# Altium project Sist. de Seguridad LilyGO.PrjPcb
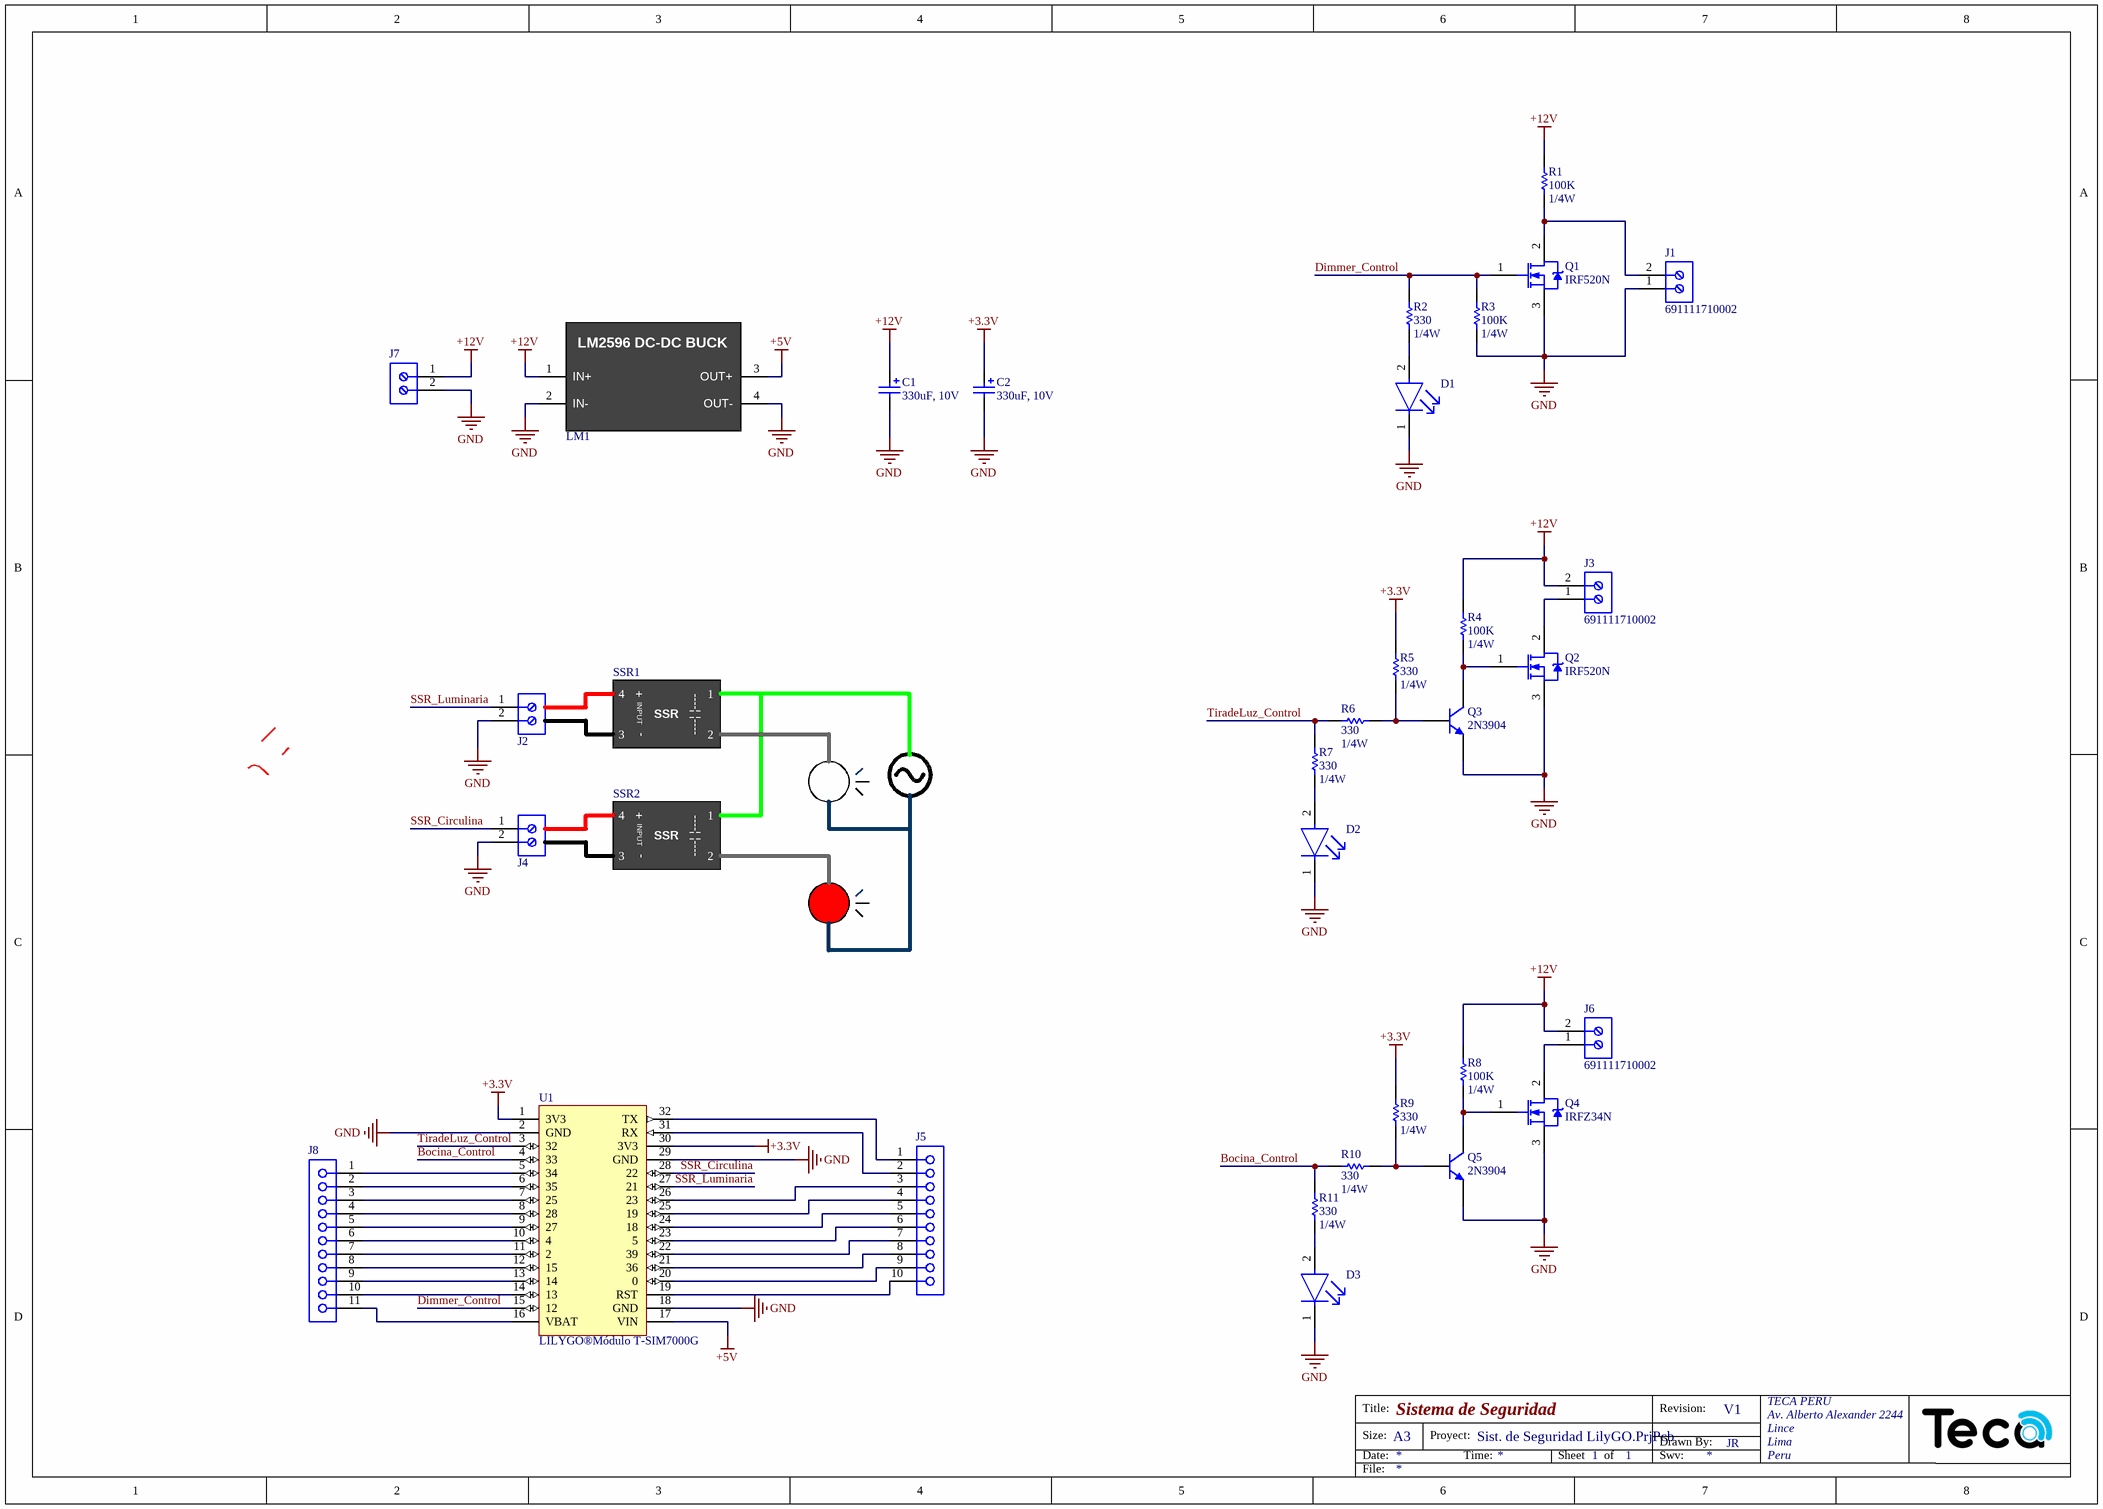
[diagram p0: Ctrl Sist de seguridad SCH.SchDoc]
CAGE_CODE: ?????; CONTRACT_NUMBER: <CONTRACT NO>; DOC_NO_ASSY_DWG: <ASSY DWG NO>; DOC_NO_BOM: <BOM DOC NO>; DOC_NO_FAB_DWG: <FAB DWG NO>; DOC_NO_SCH_DWG: <SCH DWG NO>; PCB_2_DEC_TOL: +/-.01; PCB_3_DEC_TOL: +/-.010; PCB_ANG_TOL: +/-1/2; PCB_ASSEMBLY_NO: <PCB ASSY NO>; PCB_CHECKER: - -----; PCB_CHECKER_APP_DATE: --/--/----; PCB_DESIGNER: - -----; PCB_DESIGNER_APP_DATE: --/--/----; PCB_DWG_NO: <PCB DWG NO>; PCB_ENGINEER: - -----; PCB_ENGINEER_APP_DATE: --/--/----; PCB_PART_NUMBER: <PCB PN>; PCB_REV: A; SCH_REV: A
1 sheet, 33 parts. Net scope: global (net labels, ports and power ports of the same name join across sheets).
Board file: Ctrl Sist de seguridad PCB.PcbDoc

## Sheet Ctrl Sist de seguridad SCH.SchDoc: Sistema de Seguridad
size A3; DrawnBy: JR; Organization: TECA PERU; Address1: Av. Alberto Alexander 2244; Address2: Lince; Address3: Lima; Address4: Peru; Revision: V1; SheetNumber: 1; SheetTotal: 1; ENG_APP_DATE: --/--/--; DSN_APP_DATE: --/--/--; CHK_APP_DATE: --/--/--

### Parts
C1  330uF, 10V  [WCAP-ATLI_D8H11.5]
C2  330uF, 10V  [WCAP-ATLI_D8H11.5]
D1  HLMP-4700  [FP-HLMP-4700-MFG]  (value not drawn)
D2  HLMP-4700  [FP-HLMP-4700-MFG]  (value not drawn)
D3  HLMP-4700  [FP-HLMP-4700-MFG]  (value not drawn)
J1  691111710002  [691111710002]
J2  691111710002  [691111710002]  (value not drawn)
J3  691111710002  [691111710002]
J4  691111710002  [691111710002]  (value not drawn)
J5  61301011821  [61301011821]  (value not drawn)
J6  691111710002  [691111710002]
J7  691111710002  [691111710002]  (value not drawn)
J8  61301111821  [61301111821]  (value not drawn)
LM1  LM2596?  [LM2596]  (value not drawn)
Q1  IRF520N  [INTR-TO-220AB-3]
Q2  IRF520N  [INTR-TO-220AB-3]
Q3  2N3904  [TO-92A]
Q4  IRFZ34N  [INTR-TO-220AB-3]
Q5  2N3904  [TO-92A]
R1  Resistance: 100K  Power Rating: 1/4W  [RESISTOR 1/4W - 10mm]  (hidden comment: Resistor 1/4W)
R2  Resistance: 330  Power Rating: 1/4W  [RESISTOR 1/4W - 10mm]  (hidden comment: Resistor 1/4W)
R3  Resistance: 100K  Power Rating: 1/4W  [RESISTOR 1/4W - 10mm]  (hidden comment: Resistor 1/4W)
R4  Resistance: 100K  Power Rating: 1/4W  [RESISTOR 1/4W - 10mm]  (hidden comment: Resistor 1/4W)
R5  Resistance: 330  Power Rating: 1/4W  [RESISTOR 1/4W - 10mm]  (hidden comment: Resistor 1/4W)
R6  Resistance: 330  Power Rating: 1/4W  [RESISTOR 1/4W - 10mm]  (hidden comment: Resistor 1/4W)
R7  Resistance: 330  Power Rating: 1/4W  [RESISTOR 1/4W - 10mm]  (hidden comment: Resistor 1/4W)
R8  Resistance: 100K  Power Rating: 1/4W  [RESISTOR 1/4W - 10mm]  (hidden comment: Resistor 1/4W)
R9  Resistance: 330  Power Rating: 1/4W  [RESISTOR 1/4W - 10mm]  (hidden comment: Resistor 1/4W)
R10  Resistance: 330  Power Rating: 1/4W  [RESISTOR 1/4W - 10mm]  (hidden comment: Resistor 1/4W)
R11  Resistance: 330  Power Rating: 1/4W  [RESISTOR 1/4W - 10mm]  (hidden comment: Resistor 1/4W)
SSR1  SSR  [SSR Generic]  (value not drawn)
SSR2  SSR  [SSR Generic]  (value not drawn)
U1  LILYGO®Módulo T-SIM7000G  [LILYGO T-SIM7000G]

### Nets
+3.3V: C2.1(P) R5.2 R9.2 U1.1(3V3) U1.30(3V3)
+5V: LM1.3(OUT+) U1.17(VIN)
+12V: C1.1(P) J3.2 J6.2 J7.1 LM1.1(IN+) R1.2 R4.2 R8.2
GND: C1.2(N) C2.2(N) D1.1(C) D2.1(C) D3.1(C) J1.1 J2.2 J4.2 J7.2 LM1.2(IN-) LM1.4(OUT-) Q1.3(S) Q2.3(S) Q3.1(E) Q4.3(S) Q5.1(E) R3.1 U1.2(GND) U1.18(GND) U1.29(GND)
Bocina_Control: R10.2 R11.1 U1.4(33)
Dimmer_Control: Q1.1(G) R2.2 R3.2 U1.15(12)
SSR_Circulina: J4.1 U1.28(22)
SSR_Luminaria: J2.1 U1.27(21)
TiradeLuz_Control: R6.2 R7.1 U1.3(32)
NetD1_2: D1.2(A) R2.1
NetD2_2: D2.2(A) R7.2
NetD3_2: D3.2(A) R11.2
NetJ1_2: J1.2 Q1.2(D) R1.1
NetJ3_1: J3.1 Q2.2(D)
NetJ5_1: J5.1 U1.32(TX)
NetJ5_2: J5.2 U1.31(RX)
NetJ5_3: J5.3 U1.26(23)
NetJ5_4: J5.4 U1.25(19)
NetJ5_5: J5.5 U1.24(18)
NetJ5_6: J5.6 U1.23(5)
NetJ5_7: J5.7 U1.22(39)
NetJ5_8: J5.8 U1.21(36)
NetJ5_9: J5.9 U1.20(0)
NetJ5_10: J5.10 U1.19(RST)
NetJ6_1: J6.1 Q4.2(D)
NetJ8_1: J8.1 U1.5(34)
NetJ8_2: J8.2 U1.6(35)
NetJ8_3: J8.3 U1.7(25)
NetJ8_4: J8.4 U1.8(28)
NetJ8_5: J8.5 U1.9(27)
NetJ8_6: J8.6 U1.10(4)
NetJ8_7: J8.7 U1.11(2)
NetJ8_8: J8.8 U1.12(15)
NetJ8_9: J8.9 U1.13(14)
NetJ8_10: J8.10 U1.14(13)
NetJ8_11: J8.11 U1.16(VBAT)
NetQ2_1: Q2.1(G) Q3.3(C) R4.1
NetQ3_2: Q3.2(B) R5.1 R6.1
NetQ4_1: Q4.1(G) Q5.3(C) R8.1
NetQ5_2: Q5.2(B) R9.1 R10.1

### Notes on the sheet
- Title:
- Size:
- Date:
- A3
- Proyect:
- Time:
- Sheet
- of
- Revision:
- Drawn By:
- Swv:
- File:
- (in symbol LM2596?) LM2596 DC-DC BUCK
- (in symbol SSR) 4; +; 1; INPUT; ----| |----; 3; -; 2

### Library data of the parts
C1 C2 = 860080274009: WCAP-ATLI Aluminum Electrolytic Capacitor, Radial, THT, D8xH11.5mm, 330uF, 10V; Manufacturer: Wurth Elektronik; Ripple Current: 540mA; Technical Reference: ATEE115331M010DSPA7C000; Rated Voltage: 10VDC; Leakage Current: 33uA; Endurance: 3000h; Dissipation Factor: 14%; Capacitance Tolerance: +/-20%; Capacitance: 330uF; Manufacturer Part Number: 860080274009; Published Date: October 2020; Packaging: Ammo Pack; Operating Temperature: -55 to +105degC; Mounting Technology: THT; Height: 11.5mm; Diameter: 8mm; ComponentLink2URL: https://www.we-online.com/catalog/datasheet/860080274009.pdf; ComponentLink2Description: Datasheet; ComponentLink1URL: http://www.we-online.de; ComponentLink1Description: Manufacturer
D1-D3 = CMP-18399-000008-1: LED RED DIFFUSED T-1 3/4 T/H; Manufacturer: Broadcom; Luminous Intensity: 2.3mcd; Peak Emmision Wavelength: 635nm; Forward Voltage: 1.7V; Viewing Angle: 50°; Led Orientation: Straight; Reverse Voltage: 5V; Forward Current: 2mA; Power Dissipation: 14mW; Wavelength: 626nm; Digikey Description: LED RED DIFFUSED T-1 3/4 T/H; Device Class L3: unset; Temperature Range Low: -40°C; Temperature Range High: +100°C; RoHS: TRUE; Package: HLMP-4700; Octopart: https://octopart.com/hlmp-4700-broadcom-71130526; Automotive: No; ComponentLink2URL: https://docs.broadcom.com/docs/AV02-1557EN; Colour: Red; Temperature: -40°C to +100°C; Lead Free: Yes; Category: Diode; ComponentLink2Description: Datasheet; Manufacturer Part Number: HLMP-4700; Device Class L1: Optoelectronics; Device Class L2: LEDs; Mouser Description: LED; Red; 2.3mcd; 0.24In.Dia.; T-1-3/4; 500mA; 1.7V; 635nm; 50deg; 5V; 24mW; -55degC;
J1-J4 J6 J7 = 691111710002: WR-TBL Serie 111 Horizontal Entry Modular, Pressure Clamp, THT, pitch 5mm, 2p; Manufacturer: Wurth Elektronik; Modularity: Yes; PCB/Cable/Panel: PCB; Pin Number: 2; Rated Current [UL]: 15A; Working Voltage [UL]: 250VAC; ComponentLink1Description: Manufacturer; ComponentLink1URL: http://www.we-online.de; ComponentLink2URL: https://katalog.we-online.de/em/datasheet/691111710002.pdf; ComponentLink2Description: Datasheet; Mounting Technology: THT; Manufacturer Part Number: 691111710002; Packaging: Box; Operating Temperature: -40 to +105degC; Pitch: 5mm; Published Date: Feburary 2021; Type: Horizontal; Application: Pressure Clamp
J5 = 61301011821: WR-PHD Socket Header, THT, pitch 2.54mm, Single Row, Vertical, 10p; Manufacturer: Wurth Elektronik; Pin Number: 10; Rated Current: 3A; Working Voltage: 250VAC; Withstanding Voltage: 500VAC; Contact Resistance: 20mOhm; ComponentLink1Description: Manufacturer; ComponentLink1URL: http://www.we-online.de; ComponentLink2Description: Datasheet; ComponentLink2URL: https://www.we-online.com/catalog/datasheet/61301011821.pdf; Manufacturer Part Number: 61301011821; Published Date: May 2020; Pitch: 2.54mm; Operating Temperature: -40 to +125degC; Mounting Technology: THT; Packaging: Tray; Gender: Socket Header; Row Number: Single; Orientation: Vertical
J8 = 61301111821: WR-PHD Socket Header, THT, pitch 2.54mm, Single Row, Vertical, 11p; Manufacturer: Wurth Elektronik; Pin Number: 11; Rated Current: 3A; Working Voltage: 250VAC; Withstanding Voltage: 500VAC; Contact Resistance: 20mOhm; ComponentLink1Description: Manufacturer; ComponentLink1URL: http://www.we-online.de; ComponentLink2Description: Datasheet; ComponentLink2URL: https://www.we-online.com/catalog/datasheet/61301111821.pdf; Manufacturer Part Number: 61301111821; Published Date: May 2020; Pitch: 2.54mm; Operating Temperature: -40 to +125degC; Mounting Technology: THT; Packaging: Tray; Gender: Socket Header; Row Number: Single; Orientation: Vertical
LM1 = LM2596?: Módulo de DC-DC LM2596, regulador de convertidor Buck de reducción ajustable, VIN: 3,2 V-40V ; VOUT: 1,25 V-35V
Q1 Q2 Q4 = CMP-2100-03647-1: HEXFET(R) Power MOSFET, 100 V, 9.7 A, 0.2 Ohm, -55 to 175 degC, 3-Pin FM (TO-220AB), RoHS, Tube; Manufacturer: International Rectifier; Element Configuration: Single; Rds On Max: 200mOhm; Drain to Source Voltage (Vdss): 100V; Number of Elements: 1; Continuous Drain Current (ID): 9.7A; Input Capacitance: 330pF; Gate to Source Voltage (Vgs): 20V; Power Dissipation: 48W; Rise Time: 23ns; Turn-Off Delay Time: 32ns; Turn-On Delay Time: 4.5ns; Datasheet URL: http://www.infineon.com/dgdl/irf520npbf.pdf?fileId=5546d462533600a4015355e340711985; Max Operating Temperature: 175degC; Height: 15.24mm; RoHSCompliant: true; Package Description: 3-Pin Flange Mount, Body 4.445 x 10.415 mm, Pitch 2.54 mm; Manufacturer URL: http://internationalrectifier.com/; Length: 10.54mm; Mount: ThroughHole; Lead Free: LeadFree; Drain to Source Resistance: 200mOhm; Drain to Source Breakdown Voltage: 100V; Number of Pins: 3; Case/Package: TO-220AB; Package Quantity: 50; Lead Pitch: 2.54mm; REACH SVHC: NoSVHC; Package Reference: TO-220AB; Radiation Hardening: No; Packaging: Rail/Tube; Min Operating Temperature: -55degC; Width: 4.69mm; Fall Time: 23ns; Max Power Dissipation: 48W; Datasheet Version: 37926.0; Voltage Rating (DC): 100V; Current Rating: 9.7A
Q3 Q5 = 2N3904: NPN General Purpose Amplifier; Published: 8-Jun-2000; LatestRevisionDate: 15-Jan-2003; LatestRevisionNote: PCB Footprint 'BCY-W3/D4.7' replaced; DatasheetVersion: 1997; PackageVersion: Sep-1998; PackageReference: TO-92A; Publisher: Altium Limited; PackageDescription: TO, Flat Index; 3 In-Line, Axial Leads; Body Dia. 4.5mm; Leads 0.51 x 0.48 mm (max); ComponentLink1Description: Manufacturer Link; ComponentLink1URL: http://www.fairchildsemi.com/; ComponentLink2Description: Datasheet; ComponentLink2URL: http://www.fairchildsemi.com/ds/2N%2F2N3904.pdf
R1-R11 = Resistor 1/4W: Tolerance: 1%; Case/Package: Axial; Category: Through-Hole Resistors; Mount: Through Hole; Length: 6.3mm
U1 = LILYGO®Módulo T-SIM7000G: LILYGO®Módulo de T-SIM7000G TTGO, Chip de ESP32-WROVER-B, WiFi, Bluetooth 18650, soporte de batería, placa de carga Solar